# EAGLE schematic imu_node (EAGLE 9.1.3)
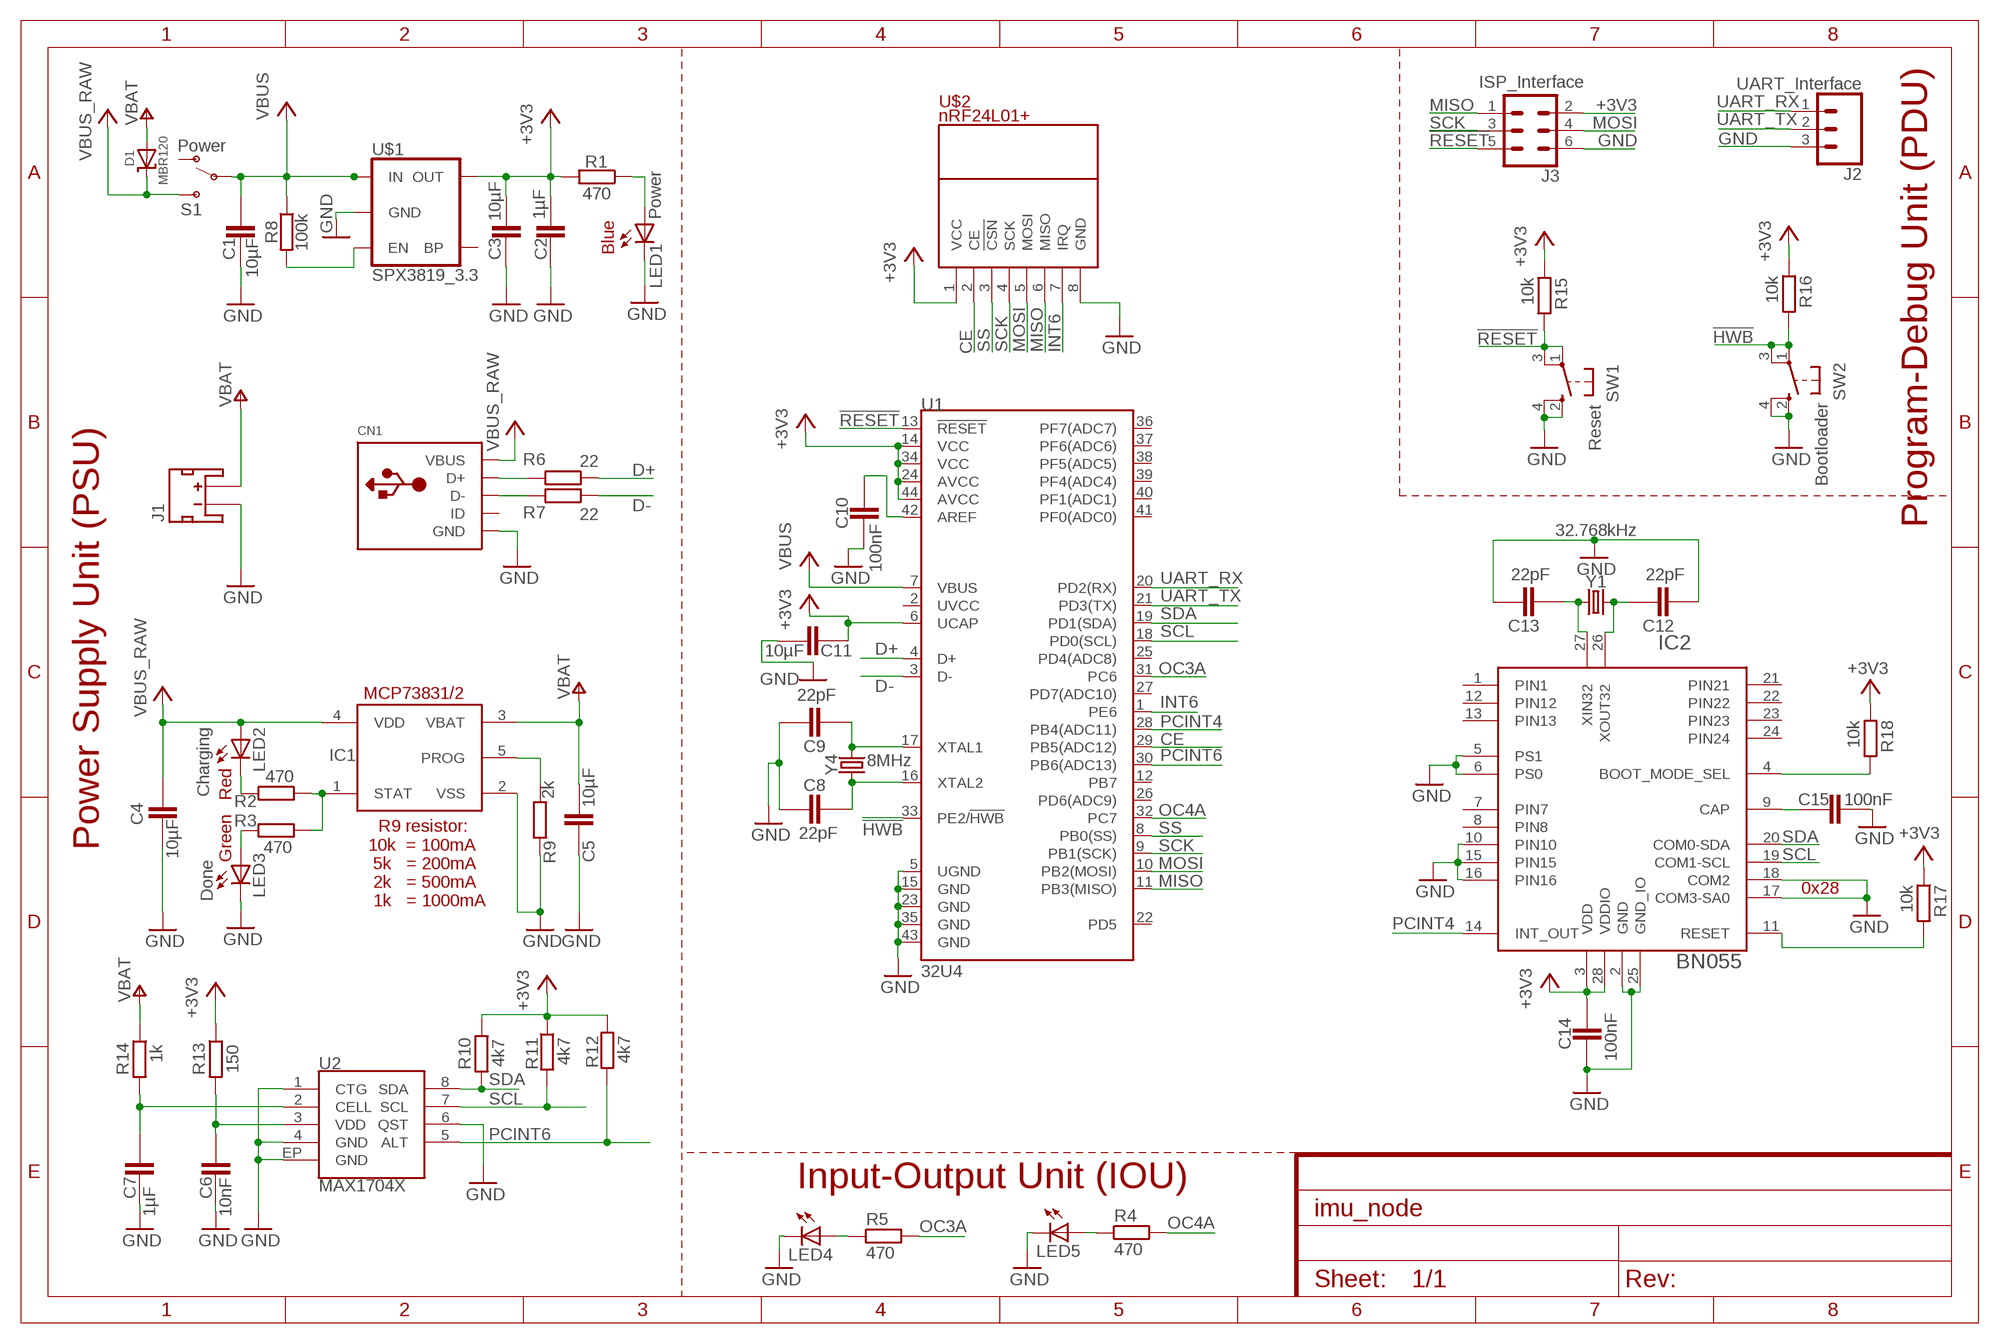
[diagram p0: schematic, sheet 1]

## Parts
C1  10µF  CAPACITOR_0603  [CAPC1608X92N]
C2  1µF  CAPACITOR_0603  [CAPC1608X92N]
C3  10µF  CAPACITOR_0603  [CAPC1608X92N]
C4  10µF  CAPACITOR_0603  [CAPC1608X92N]
C5  10µF  CAPACITOR_0603  [CAPC1608X92N]
C6  10nF  CAPACITOR_0603  [CAPC1608X92N]
C7  1µF  CAPACITOR_0603  [CAPC1608X92N]
C8  22pF  CAPACITOR_0603  [CAPC1608X92N]
C9  22pF  CAPACITOR_0603  [CAPC1608X92N]
C10  100nF  CAPACITOR_0603  [CAPC1608X92N]
C11  10µF  CAPACITOR_0603  [CAPC1608X92N]
C12  22pF  CAPACITOR_0603  [CAPC1608X92N]
C13  22pF  CAPACITOR_0603  [CAPC1608X92N]
C14  100nF  CAPACITOR_0603  [CAPC1608X92N]
C15  100nF  CAPACITOR_0603  [CAPC1608X92N]
CN1  USBMINIB  [USB-MINIB]
D1  MBR120  DIODE_SOD-123FL  [SOD-123FL]
IC1  MCP73831/OT  [SOT23-5L]
IC2  BN055  1658_BNO055  [LGA-28_3.80X5.20/0.5]
J1  LiPo Battery  JST_2MM_MALE  [JST-2-SMD]
J2  UART_Interface  CONN_03  [1X03]
J3  ISP_Interface  CONN_03X2FEMALE  [2X3]
LED1  Power  LEDCHIPLED_0603  [CHIPLED_0603]
LED2  Charging  LEDCHIPLED_0603  [CHIPLED_0603]
LED3  Done  LEDCHIPLED_0603  [CHIPLED_0603]
LED4  LEDCHIPLED_0603  [CHIPLED_0603]
LED5  LEDCHIPLED_0603  [CHIPLED_0603]
R1  470  RESISTOR_0603  [RESC1608X55N]
R2  470  RESISTOR_0603  [RESC1608X55N]
R3  470  RESISTOR_0603  [RESC1608X55N]
R4  470  RESISTOR_0603  [RESC1608X55N]
R5  470  RESISTOR_0603  [RESC1608X55N]
R6  22  RESISTOR_0603  [RESC1608X55N]
R7  22  RESISTOR_0603  [RESC1608X55N]
R8  100k  RESISTOR_0603  [RESC1608X55N]
R9  2k  RESISTOR_0603  [RESC1608X55N]
R10  4k7  RESISTOR_0603  [RESC1608X55N]
R11  4k7  RESISTOR_0603  [RESC1608X55N]
R12  4k7  RESISTOR_0603  [RESC1608X55N]
R13  150  RESISTOR_0603  [RESC1608X55N]
R14  1k  RESISTOR_0603  [RESC1608X55N]
R15  10k  RESISTOR_0603  [RESC1608X55N]
R16  10k  RESISTOR_0603  [RESC1608X55N]
R17  10k  RESISTOR_0603  [RESC1608X55N]
R18  10k  RESISTOR_0603  [RESC1608X55N]
S1  Power  SWITCH-SPDT-SMD-RIGHT-ANGLE  [SWITCH_SPST_SMD_A]
SW1  Reset  SPST_TACT-KMR2  [KMR2]
SW2  Bootloader  SPST_TACT-KMR2  [KMR2]
U1  32U4  ATMEGA32U4TQFP-44  [TQFP44]
U2  MAX1704X  [TDFN-8]
U$1  SPX3819_3.3  V_REG_SPX3819-SOT23-5  [SOT23-5]
U$2  nRF24L01+  6-PIN-BREAKOUT6-PIN-BREAKOUT  [6-PIN-BREAKOUT]
Y1  32.768kHz  CRYSTAL-32.768KHZSMD-3.2X1.5  [CRYSTAL-SMD-3.2X1.5MM]
Y4  8MHz  CRYSTAL-8MHZSMD-5X3.2  [CRYSTAL-SMD-5X3.2-4PAD]

## Nets
!HWB!: R16.2 SW2.1(P) SW2.3(P1) U1.33(PE2/!HWB)
!RESET!: J3.5 R15.2 SW1.1(P) SW1.3(P1) U1.13(!RESET)
+3V3: C2.2 C3.2 C11.1 C14.1 IC2.3(VDD) IC2.28(VDDIO) J3.2 R1.2 R10.1 R11.1 R12.1 R13.1 R15.1 R16.1 R17.1 R18.1 U1.6(UCAP) U1.14(VCC) U1.24(AVCC) U1.34(VCC) U1.44(AVCC) U$1.5(OUT) U$2.1(VCC)
CE: U1.29(PB5(ADC12)) U$2.2(CE)
D+: R6.1 U1.4(D+)
D-: R7.1 U1.3(D-)
GND: C1.1 C2.1 C3.1 C4.1 C5.1 C6.1 C7.1 C8.2 C9.2 C10.2 C11.2 C12.1 C13.2 C14.2 C15.2 CN1.GND IC1.2(VSS) IC2.2(GND) IC2.5(PS1) IC2.6(PS0) IC2.10(PIN10) IC2.15(PIN15) IC2.16(PIN16) IC2.17(COM3-SA0) IC2.18(COM2) IC2.25(GND_IO) J1.1(-) J2.3 J3.6 LED1.C LED3.C LED4.C LED5.C R9.2 SW1.2(S) SW1.4(S1) SW2.2(S) SW2.4(S1) U1.5(UGND) U1.15(GND) U1.23(GND) U1.35(GND) U1.43(GND) U2.1(CTG) U2.4(GND) U2.6(QST) U2.EP(GND) U$1.2(GND) U$2.8(GND)
INT6: U1.1(PE6) U$2.7(IRQ)
MISO: J3.1 U1.11(PB3(MISO)) U$2.6(MISO)
MOSI: J3.4 U1.10(PB2(MOSI)) U$2.5(MOSI)
N$1: CN1.D+ R6.2
N$2: CN1.D- R7.2
N$3: IC1.5(PROG) R9.1
N$4: LED2.C R2.2
N$5: R8.2 U$1.3(EN)
N$6: C13.1 IC2.27(XIN32) Y1.P$1
N$7: LED1.A R1.1
N$8: IC1.1(STAT) R2.1 R3.1
N$9: LED3.A R3.2
N$10: C9.1 U1.17(XTAL1) Y4.3
N$11: C8.1 U1.16(XTAL2) Y4.1
N$12: C10.1 U1.42(AREF)
N$13: C6.2 R13.2 U2.3(VDD)
N$14: C7.2 R14.2 U2.2(CELL)
N$15: LED4.A R5.1
N$16: C12.2 IC2.26(XOUT32) Y1.P$2
N$17: LED5.A R4.1
N$19: IC2.11(RESET) R17.2
N$20: C15.1 IC2.9(CAP)
N$21: IC2.4(BOOT_MODE_SEL) R18.2
OC3A: R5.2 U1.31(PC6)
OC4A: R4.2 U1.32(PC7)
PCINT4: IC2.14(INT_OUT) U1.28(PB4(ADC11))
PCINT6: R12.2 U1.30(PB6(ADC13)) U2.5(ALT)
SCK: J3.3 U1.9(PB1(SCK)) U$2.4(SCK)
SCL: IC2.19(COM1-SCL) R11.2 U1.18(PD0(SCL)) U2.7(SCL)
SDA: IC2.20(COM0-SDA) R10.2 U1.19(PD1(SDA)) U2.8(SDA)
SS: U1.8(PB0(SS)) U$2.3(!CSN!)
UART_RX: J2.1 U1.20(PD2(RX))
UART_TX: J2.2 U1.21(PD3(TX))
VBAT: C5.2 D1.A IC1.3(VBAT) J1.2(+) R14.1
VBUS: C1.2 R8.1 S1.2(P) U1.7(VBUS) U$1.1(IN)
VBUS_RAW: C4.2 CN1.VBUS D1.C IC1.4(VDD) LED2.A S1.3(S)
Unconnected: CN1.ID IC2.1(PIN1) IC2.7(PIN7) IC2.8(PIN8) IC2.12(PIN12) IC2.13(PIN13) IC2.21(PIN21) IC2.22(PIN22) IC2.23(PIN23) IC2.24(PIN24) J1.NC1(PAD1) J1.NC2(PAD2) S1.1(O) U1.2(UVCC) U1.12(PB7) U1.22(PD5) U1.25(PD4(ADC8)) U1.26(PD6(ADC9)) U1.27(PD7(ADC10)) U1.36(PF7(ADC7)) U1.37(PF6(ADC6)) U1.38(PF5(ADC5)) U1.39(PF4(ADC4)) U1.40(PF1(ADC1)) U1.41(PF0(ADC0)) U$1.4(BP)

## Notes on the sheet
- Program-Debug Unit (PDU)
- nRF24L01+
- Blue
- Red
- Power Supply Unit (PSU)
- Green
- 0x28
- R9 resistor:
  10k  = 100mA
   5k   = 200mA
   2k   = 500mA
   1k   = 1000mA
- Input-Output Unit (IOU)

## Library data of the parts
C1-C15 = ipc-7351-capacitor:CAPACITOR_
CN1 = adafruit:USB: USB Connectors USBMINIB - Surface Mount Female Mini-B USB Connector 4UConnector: 06564 By microbuilder.eu Thru-hole RA Female Mini-B USB Connector 4UConnector: 18732 By ladyada.net
D1 = adafruit:DIODE: Diode SMADIODE - SMA Surface Mount Package 20V 1A Schottky Diode Digikey: 641-1014-6-ND DO-1N4148 - Through Hole Small Current Diode SOD-123 20V 1 A (.5mV Vf) Schottky Diode - Digikey: MBRX120TPMSCT-ND SOD-323 10V 570mA (.38mV Vf, 3ns) Schottky Diode - Digikey: ZLLS410CT-ND SOD-523 30V 30mA Schottky Diode (RB751S-40TE61) - Digikey: RB751S-40TE61CT-ND SOT23-R/W - SOT23 Package (R = Solder Paste/Reflow Ovens, W = Hand-Soldering) BAT54Film 40V 300mA - Digikey: 497-7162-1-ND
IC1 = adafruit:MCP73831: MCP73831/2 Miniature Single-Cell, Fully Integrated Li-Ion, Li-Polymer Charge Management Controllers. Nice and small simple lipoly charge controller, with adjustable current and status output (LED) http://www.ladyada.net/library/pcb/eaglelibrary.html
IC2 = BNO055:1658_BNO055: BN055 Intelligent 9-axis absolute orientation sensor; PART_NUMBER: BNO055
J1 = SparkFun-Connectors:JST_2MM_MALE: JST 2MM MALE RA CONNECTOR Two pin, compact surface mount connector. Commonly used as a battery input connection point. We really like the solid locking feeling and high current rating on these small connectors. We use these all the time as battery connectors. Mates to single-cell LiPo batteries. Here is the connector we sell at SparkFun: JST Right Angle Connector - White <https://www.sparkfun.com/products/8612> (PRT-08612) Datasheet <http://www.sparkfun.com/datasheets/Prototyping/Connectors/JST-Horizontal.pdf> It was used on these SparkFun products: SparkFun MOSFET Power Controller <https://www.sparkfun.com/products/11214> (PRT-11214) SparkFun Battery Babysitter - LiPo Battery Manager <https://www.sparkfun.com/products/13777> (PRT-13777) And many, many others that required a lipo battery connection.; PROD_ID: CONN-11443; SF_ID: PRT-08612
J2 = SparkFun-Connectors:CONN_03: Multi connection point. Often used as Generic Header-pin footprint for 0.1 inch spaced/style header connections On any of the 0.1 inch spaced packages, you can populate with these: Break Away Headers - Straight <https://www.sparkfun.com/products/116> (PRT-00116) Break Away Male Headers - Right Angle <https://www.sparkfun.com/products/553> (PRT-00553) Female Headers <https://www.sparkfun.com/products/115> (PRT-00115) Break Away Headers - Machine Pin <https://www.sparkfun.com/products/117> (PRT-00117) Break Away Female Headers - Swiss Machine Pin <https://www.sparkfun.com/products/743> (PRT-00743) Stackable Header - 3 Pin (Female, 0.1") <https://www.sparkfun.com/products/13875> (PRT-13875) For SCREWTERMINALS and SPRING TERMINALS visit here: Screw Terimnals on SparkFun.com <https://www.sparkfun.com/search/results?term=Screw+Terminals> (5mm/3.5mm/2.54mm spacing) This device is also useful as a general connection point to wire up your design to another part of your project. Our various solder wires solder well into these plated through hole pads. Hook-Up Wire - Assortment (Stranded, 22 AWG) <https://www.sparkfun.com/products/11375> (PRT-11375) Hook-Up Wire - Assortment (Solid Core, 22 AWG) <https://www.sparkfun.com/products/11367> (PRT-11367) View the entire wire category on our website here <https://www.sparkfun.com/categories/141> Special notes: Molex polarized connector foot print use with SKU : PRT-08232 with associated crimp pins and housings.; PROD_ID: XXX-00000; VALUE: 455-1750-1-ND
J3 = SparkFun-Connectors:CONN_03X2: Multi connection point. Often used as Generic Header-pin footprint for 0.1 inch spaced/style header connections You can populate with any combo of single row headers, but if you'd like an exact match, check these: Header - 2x3 (Male, 0.1") <https://www.sparkfun.com/products/12807> (PRT-12807) Header - 2x3 (Female, 0.1") <https://www.sparkfun.com/products/13010> (PRT-13010) 2x3 Pin Shrouded Header <https://www.sparkfun.com/products/10877> (PRT-10877) On any of the 0.1 inch spaced packages, you can populate with these: Break Away Headers - Straight <https://www.sparkfun.com/products/116> (PRT-00116) Break Away Male Headers - Right Angle <https://www.sparkfun.com/products/553> (PRT-00553) Female Headers <https://www.sparkfun.com/products/115> (PRT-00115) Break Away Headers - Machine Pin <https://www.sparkfun.com/products/117> (PRT-00117) Break Away Female Headers - Swiss Machine Pin <https://www.sparkfun.com/products/743> (PRT-00743) Special note: the shrouded connector mates well with our 3x2 ribbon cables: Ribbon Crimp Connector - 6-pin (2x3, Female) <https://www.sparkfun.com/products/10651> (PRT-10651) Ribbon Cable - 6 wire (15ft) <https://www.sparkfun.com/products/10646> (PRT-10646); PROD_ID: CONN-11566; VALUE: FEMALE 2x3
LED1-LED5 = adafruit:LED: LED OSRAM: - CHIPLED LG R971, LG N971, LY N971, LG Q971, LY Q971, LO R971, LY R971 LH N974, LH R974 LS Q976, LO Q976, LY Q976 LO Q996 - Hyper CHIPLED LW Q18S LB Q993, LB Q99A, LB R99A - SideLED LS A670, LO A670, LY A670, LG A670, LP A670 LB A673, LV A673, LT A673, LW A673 LH A674 LY A675 LS A676, LA A676, LO A676, LY A676, LW A676 LS A679, LY A679, LG A679 - Hyper Micro SIDELED® LS Y876, LA Y876, LO Y876, LY Y876 LT Y87S - SmartLED LW L88C, LW L88S LB L89C, LB L89S, LG L890 LS L89K, LO L89K, LY L89K LS L896, LA L896, LO L896, LY L896 - TOPLED LS T670, LO T670, LY T670, LG T670, LP T670 LSG T670, LSP T670, LSY T670, LOP T670, LYG T670 LG T671, LOG T671, LSG T671 LB T673, LV T673, LT T673, LW T673 LH T674 LS T676, LA T676, LO T676, LY T676, LB T676, LH T676, LSB T676, LW T676 LB T67C, LV T67C, LT T67C, LS T67K, LO T67K, LY T67K, LW E67C LS E67B, LA E67B, LO E67B, LY E67B, LB E67C, LV E67C, LT E67C LW T67C LS T679, LY T679, LG T679 LS T770, LO T770, LY T770, LG T770, LP T770 LB T773, LV T773, LT T773, LW T773 LH T774 LS E675, LA E675, LY E675, LS T675 LS T776, LA T776, LO T776, LY T776, LB T776 LHGB T686 LT T68C, LB T68C - Hyper Mini TOPLED® LB M676 - Mini TOPLED Santana® LG M470 LS M47K, LO M47K, LY M47K Source: http://www.osram.convergy.de/
R1-R18 = ipc-7351-resistor:RESISTOR_
S1 = SparkFun-Switches:SWITCH-SPDT: Single Pole, Double Throw (SPDT) Switch Single-pole, double-throw (SPDT) switch. Variant Overview SMD-AYZ0202 Surface Mount DPDT Switch <https://www.sparkfun.com/products/597> (COM-00597) Used on e.g. LilyPad Arduino USB - ATmega32U4 Board <https://www.sparkfun.com/products/12049> PTH-11.6X4.0MM SPDT Mini Power Switch <https://www.sparkfun.com/products/102> (COM-00102) Used on e.g. SparkFun Simon Says - Through-Hole Soldering Kit <https://www.sparkfun.com/products/10547> (KIT-10547) PTH-11.6X4.0MM-KIT KIT version of SPDT Mini Power Switch - Simplifies soldering by removing tStop of switch pins - only one side can be soldered. PTH-11.6X4.0MM-LOCK LOCK version of SPDT Mini Power Switch - Offset pins hold switch in place for easier soldering. SMD-RIGHT-ANGLE Surface Mount Right Angle Switch <https://www.sparkfun.com/products/10860> (COM-10860) Used on e.g. SparkFun ESP8266 Thing <https://www.sparkfun.com/products/13231>; PROD_ID: SWCH-10651; SF_SKU: COM-10860
SW1 SW2 = adafruit:SPST_TACT: SMT 6mm switch, EVQQ2 series http://www.ladyada.net/library/eagle
U1 = SparkFun-IC-Microcontroller:ATMEGA32U4: Atmel MCU, 32KByte Atmel 44-pin 8-bit Microcontroller with 32KBytes of ISP Flash and USB Controller Datasheet <http://cdn.sparkfun.com/datasheets/Dev/Arduino/Boards/ATMega32U4.pdf> SparkFun Products LilyPad Arduino USB - ATmega32U4 Board <https://www.sparkfun.com/products/12049> (DEV-12049) Pro Micro - 5V/16MHz <https://www.sparkfun.com/products/12640> (DEV-12640) Pro Micro - 3.3V/8MHz <https://www.sparkfun.com/products/12587> (DEV-12587) Fio v3 - ATmega32U4 <https://www.sparkfun.com/products/11520> (DEV-11520) Qduino Mini <https://www.sparkfun.com/products/13614> (DEV-13614) Makey Makey - Standard Kit <https://www.sparkfun.com/products/11511> (WIG-11511) Makey Makey Deluxe Kit <https://www.sparkfun.com/products/11519> (WIG-11519); PROD_ID: IC-11161
U2 = SparkFun-IC-Power:MAX1704X: MAX17043/MAX17044: Battery Fuel Guage (43 is 1cell, 44 is 2cell); PROD-ID: IC-10399
U$1 = SparkFun-IC-Power:V_REG_SPX3819: SPX3819 Voltage Regulator 3.3V 500mA, 16V input Datasheet <https://www.exar.com/content/document.ashx?id=22106> SparkFun Products: SparkFun Serial Controlled Motor Driver <https://www.sparkfun.com/products/13911>; PROD_ID: VREG-13321; VALUE: SPX3819M5_3_3
U$2 = SparkFun-nRF24L01+:6-PIN-BREAKOUT
Y1 = SparkFun-Clocks:CRYSTAL-32.768KHZ: 32.768kHz Crystal Frequency: 32.768kHz Frequency Stability: ±20ppm Load Capacitance: 12.5pF (PTH-2X6 & SMD-3.2X1.5), 6pF (SMD-2X6) SparkFun Products: SparkFun BigTime Watch Kit <https://www.sparkfun.com/products/11734> SparkFun nRF52832 Breakout <https://www.sparkfun.com/products/13990> SparkFun Real Time Clock Module <https://www.sparkfun.com/products/12708>; PROD_ID: XTAL-13062
Y4 = SparkFun-Clocks:CRYSTAL-8MHZ: 8MHz Crystal Datasheet Example <http://www.futureelectronics.com/en/technologies/electromechanical/timing-devices/crystals/Pages/6008189-ABM3B-8.000MHZ-B2-T.aspx?IM=0> Frequency: 8MHz Frequency Tolerance: ±20ppm Load Capacitance: 18pF SparkFun Products: Pro Micro -3.3V/8MHz <https://www.sparkfun.com/products/12587> WAV Trigger <https://www.sparkfun.com/products/13660>; PROD_ID: XTAL-09431